# Altium schematic sheet Puissance.SchDoc
size A3; SheetNumber: 1; SheetTotal: 2
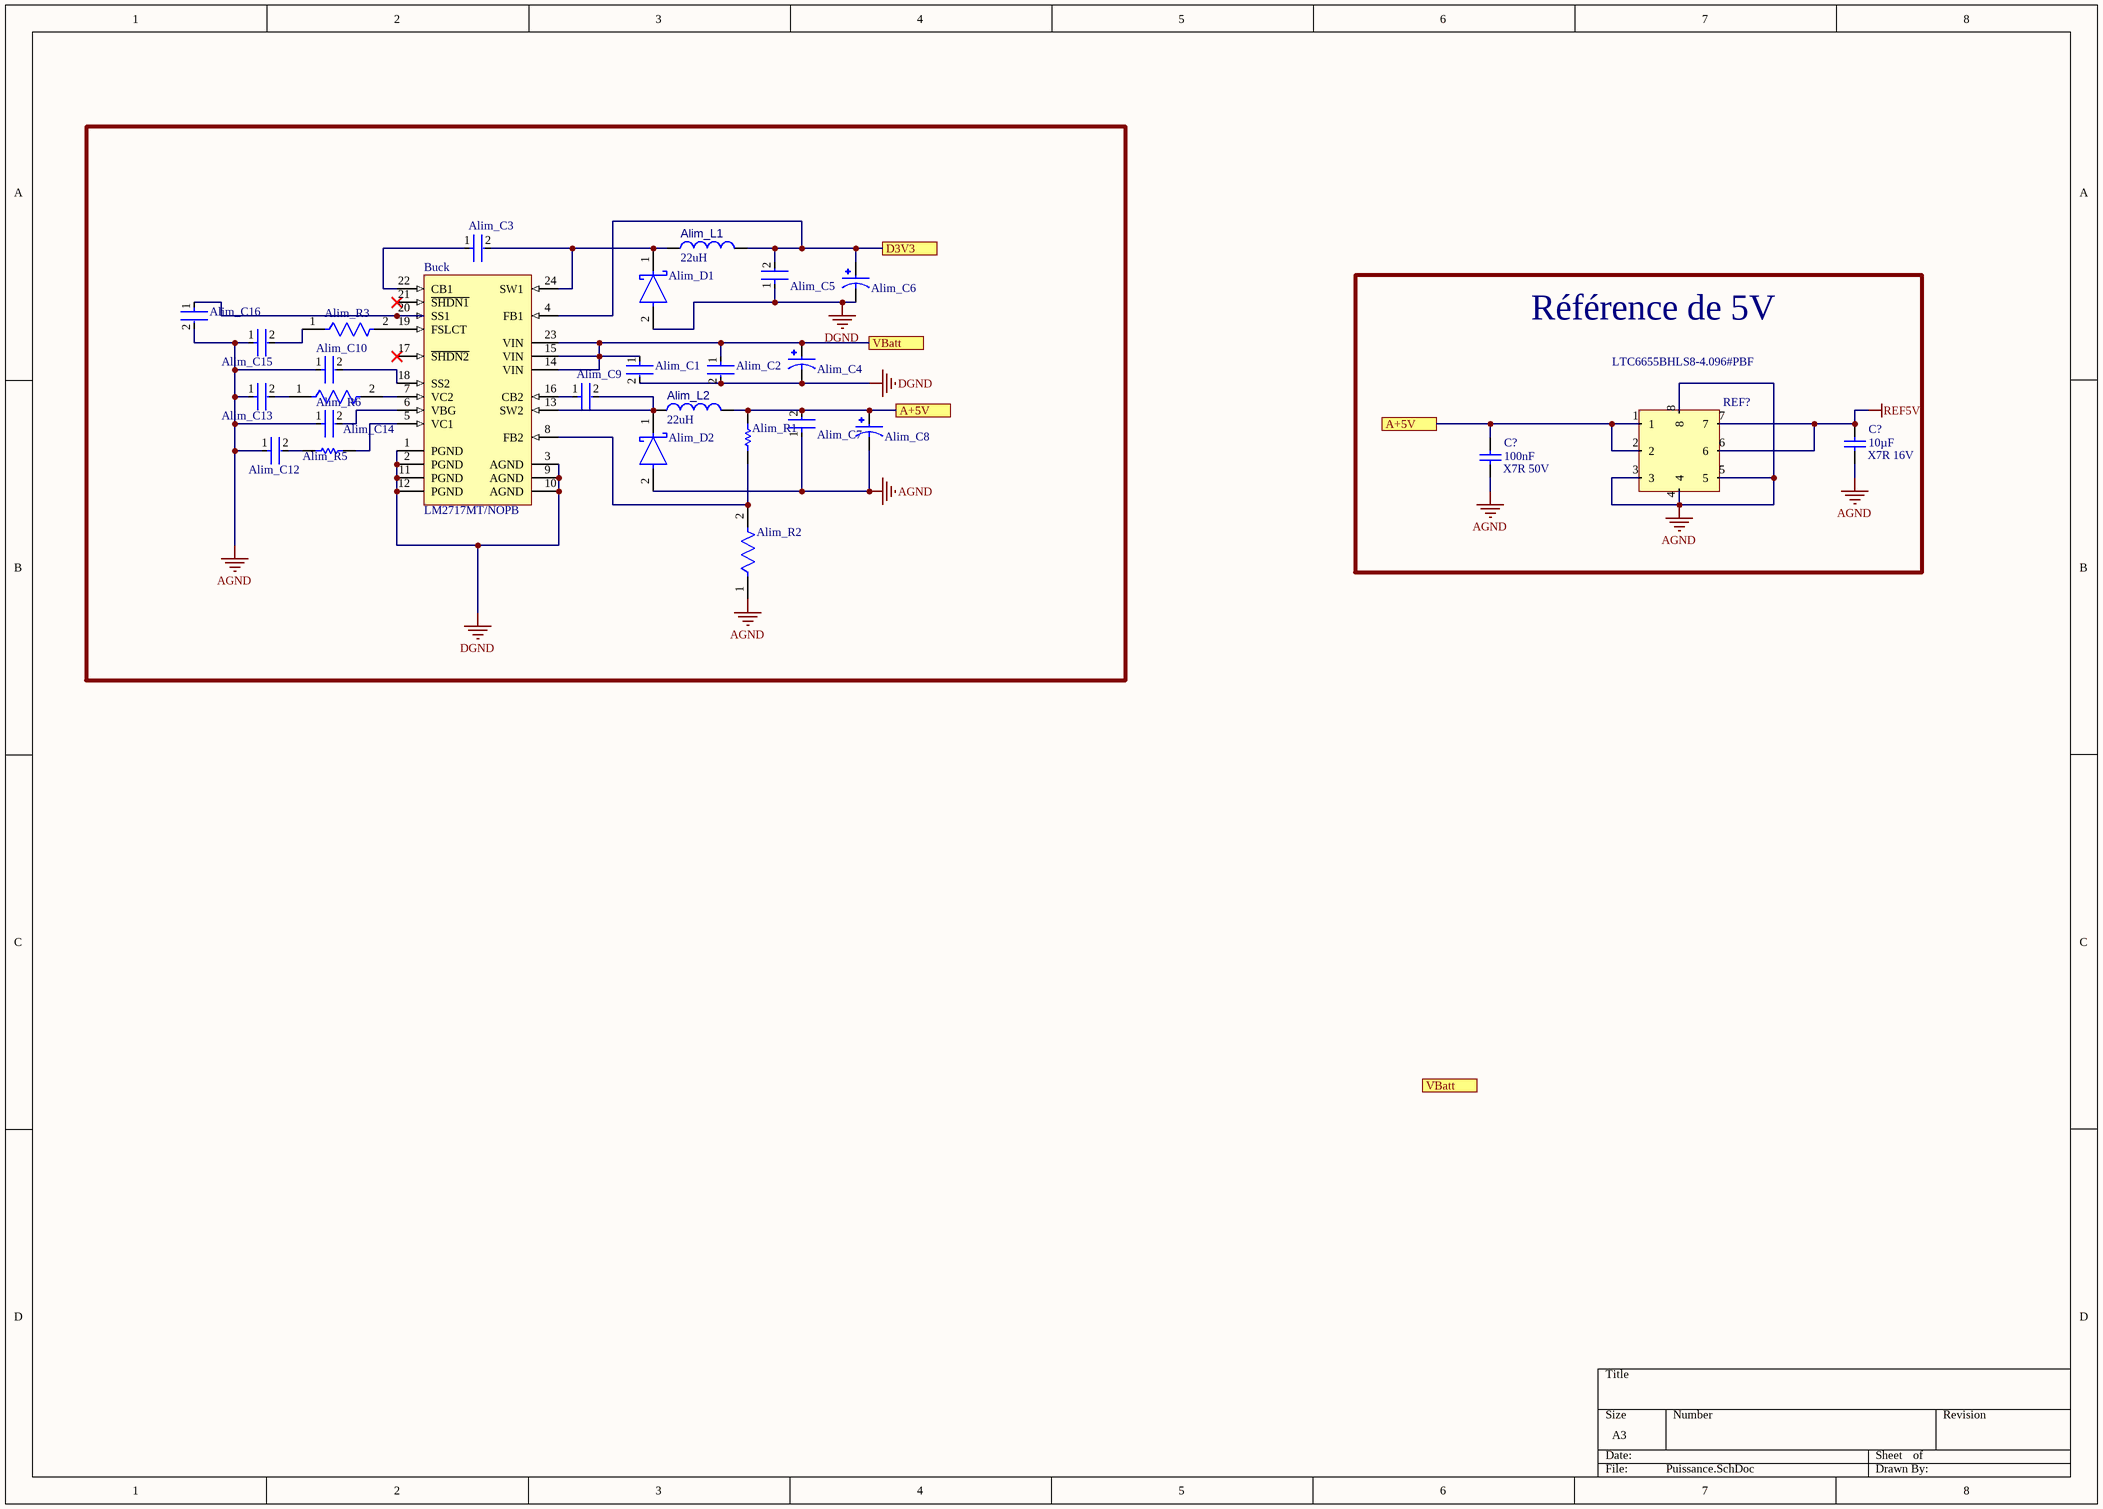
[diagram p0: Puissance.SchDoc]

## Parts
(Parts that share a designator on the sheet are numbered #1, #2 ... from top to bottom, then left to right.)
Alim_C1  C2012X5R1H475K125AB  [FP-C2012-125-0_2-IPC_B]  (value not drawn)
Alim_C2  C2012X5R1H475K125AB  [FP-C2012-125-0_2-IPC_B]  (value not drawn)
Alim_C3  CGA8P3X7T2E105K250KA  [FP-CGA8R-IPC_B]  (value not drawn)
Alim_C4  EEU-EE2G680  [EEU-EE2G680-Footprint-1]  (value not drawn)
Alim_C5  CGA8P3X7T2E105K250KA  [FP-CGA8R-IPC_B]  (value not drawn)
Alim_C6  EEU-EE2G680  [EEU-EE2G680-Footprint-1]  (value not drawn)
Alim_C7  CGA8P3X7T2E105K250KA  [FP-CGA8R-IPC_B]  (value not drawn)
Alim_C8  EEU-EE2G680  [EEU-EE2G680-Footprint-1]  (value not drawn)
Alim_C9  CGA8P3X7T2E105K250KA  [FP-CGA8R-IPC_B]  (value not drawn)
Alim_C10  06035C473K4T2A  [FP-0603-L_1_6_0_15-W_0_81-MFG]  (value not drawn)
Alim_C12  C0603C472K5RACTU  [FP-C0603C-CF-MFG]  (value not drawn)
Alim_C13  C0603C472K5RACTU  [FP-C0603C-CF-MFG]  (value not drawn)
Alim_C14  08051C102KAT2A  [FP-0805-L_2_01_0_2-W_1_25-IPC_C]  (value not drawn)
Alim_C15  C0603C472K5RACTU  [FP-C0603C-CF-MFG]  (value not drawn)
Alim_C16  06035C473K4T2A  [FP-0603-L_1_6_0_15-W_0_81-MFG]  (value not drawn)
Alim_D1  VS-30BQ100-M3/9AT  [FP-95402-MFG]  (value not drawn)
Alim_D2  VS-30BQ100-M3/9AT  [FP-95402-MFG]  (value not drawn)
Alim_L1  value 22uH  [XAL5050-223MEC-Footprint-1]  (hidden comment: XAL5050-223MEC)
Alim_L2  value 22uH  [XAL5050-223MEC-Footprint-1]  (hidden comment: XAL5050-223MEC)
Alim_R1  CRCW120659K0FKEA  [RESC3216X60X45ML10T20]  (value not drawn)
Alim_R2  MCT0603PD2002DP500  [FP-MCT0603-IPC_A]  (value not drawn)
Alim_R3  CRCW080520K5FKEA  [FP-CRCW0805-e3-MFG]  (value not drawn)
Alim_R5  RC0402FR-0710KL  [RESC1005X40X25LL05T10]  (value not drawn)
Alim_R6  MCT0603PD2002DP500  [FP-MCT0603-IPC_A]  (value not drawn)
Buck  LM2717MT/NOPB  [PW0024A_L]
C?#1  X7R 16V  value 10µF  [1206]
C?#2  X7R 50V  value 100nF  [0603]
REF?  LTC6655BHLS8-4.096#PBF  [LTC6655BHLS8-4.096#PBF-Footprint-1]

## Blocks framed on the sheet
Référence de 5V: C?#1 C?#2 REF?

## Ports
A+5V, D3V3, VBatt

## Nets
AGND: Alim_C7.1 Alim_C8.N Alim_C10.1 Alim_C12.1 Alim_C13.1 Alim_C14.1 Alim_C15.1 Alim_C16.2 Alim_D2.2(A) Alim_R2.1 C?#1.1 C?#2.1 REF?.3 REF?.4 REF?.5 REF?.8
DGND: Alim_C1.2 Alim_C2.2 Alim_C4.N Alim_C5.1 Alim_C6.N Alim_D1.2(A) Buck.1(PGND) Buck.2(PGND) Buck.3(AGND) Buck.9(AGND) Buck.10(AGND) Buck.11(PGND) Buck.12(PGND)
REF5V: C?#1.2 REF?.6 REF?.7
A+5V: Alim_C7.2 Alim_C8.P Alim_L2.2 Alim_R1.2 C?#2.2 REF?.1 REF?.2 ; port A+5V
D3V3: Alim_C5.2 Alim_C6.P Alim_L1.2 Buck.4(FB1) ; port D3V3
VBatt: Alim_C1.1 Alim_C2.1 Alim_C4.P Buck.14(VIN) Buck.15(VIN) Buck.23(VIN) ; port VBatt
NetAlim_C3_1: Alim_C3.1 Buck.22(CB1)
NetAlim_C3_2: Alim_C3.2 Alim_D1.1(C) Alim_L1.1 Buck.24(SW1)
NetAlim_C9_1: Alim_C9.1 Buck.16(CB2)
NetAlim_C9_2: Alim_C9.2 Alim_D2.1(C) Alim_L2.1 Buck.13(SW2)
NetAlim_C10_2: Alim_C10.2 Buck.18(SS2)
NetAlim_C12_2: Alim_C12.2 Alim_R5.1
NetAlim_C13_2: Alim_C13.2 Alim_R6.1
NetAlim_C14_2: Alim_C14.2 Buck.6(VBG)
NetAlim_C15_2: Alim_C15.2 Alim_R3.1
NetAlim_C16_1: Alim_C16.1 Buck.20(SS1)
NetAlim_R1_1: Alim_R1.1 Alim_R2.2 Buck.8(FB2)
NetAlim_R3_2: Alim_R3.2 Buck.19(FSLCT)
NetAlim_R5_2: Alim_R5.2 Buck.5(VC1)
NetAlim_R6_2: Alim_R6.2 Buck.7(VC2)

Not connected (* = marked no-connect by the designer): Buck 17(~{SHDN2})* 21(~{SHDN1})*

## Library data of the parts
Alim_C1 Alim_C2 = CMP-08246-000007-2: Multilayer Ceramic Capacitors 4.7μF ±10% 50V X5R SMD 0805; Capacitance: 4.7uF; Case Code (Metric): 2012; Weight: 0.000194oz; Voltage Rating: 50V; Voltage: 50V; Construction: Flat; Series: C; Packaging: Tape and Reel; Height: 1.25mm; Depth: 1.25mm; Resistor Type: Ceramic; Width: 0.049inch; Length: 2mm; Thickness: 0.057inch; REACH SVHC: No SVHC; Max Operating Temperature: 85°C; Case/Package: 0805; Dielectric: X5R; Tolerance: 10%; Dielectric Material: Ceramic; Package Quantity: 1; Mount: Surface Mount; Radiation Hardening: No; Voltage Rating (DC): 50V; Case Code (Imperial): 0805; Termination: SMD/SMT; Min Operating Temperature: -55°C; Lead Free: Lead Free
Alim_C3 Alim_C5 Alim_C7 Alim_C9 = CMP-08246-002426-1: Cap Ceramic 1uF 250V X7T 10% Pad SMD 1812 +125°C Automotive T/R; Width: 0.126inch; Length: 4.5mm; Thickness: 0.098inch; Depth: 3.2mm; Tolerance: 10%; Max Operating Temperature: 125°C; Dielectric: X7T; Case/Package: 1812; Packaging: Tape and Reel; Mount: Surface Mount; Termination: SMD/SMT; Case Code (Metric): 4532; Package Quantity: 1; Voltage Rating: 250V; Case Code (Imperial): 1812; Min Operating Temperature: -55°C; Ratings: AEC-Q200; Composition: Ceramic; REACH SVHC: No SVHC; Height: 2.5mm; Voltage Rating (DC): 250V; Capacitance: 1uF; Weight: 0.000952oz
Alim_C4 Alim_C6 Alim_C8 = CMP-001-00134-1: Capacitor; Aluminum Electrolytic; Capacitor Radial EE 68uF 400V Hi-Ripple
Alim_C10 Alim_C16 = CMP-2006-04442-2: Automotive Ceramic Capacitor, 0603, 47nF, 10%, X7R, 15%, 50V; Package Quantity: 4000; Voltage Rating: 50V; Max Operating Temperature: 125°C; RoHS Compliant: Yes; Case/Package: 0603; Voltage Rating (DC): 50V; Depth: 0.81mm; Thickness: 0.035inch; Mount: Surface Mount; Height: 0.9mm; Series: -; Tolerance: 10%; Termination: SMD/SMT; Capacitance: 47nF; Dielectric: X7R; Case Code (Metric): 1608; Lead Free: Lead Free; REACH SVHC: No SVHC; Min Operating Temperature: -55°C; Length: 1.6mm; Radiation Hardening: No; Packaging: Tape and Reel; Ratings: AEC-Q200; Width: 0.81mm; Case Code (Imperial): 0603
Alim_C12 Alim_C13 Alim_C15 = CMP-1035-02203-3: CAP CER 4700PF 50V X7R 0603; Manufacturer: KEMET; Tolerance: 0.1; Capacitance: 4,700 pF; Description: C0603 4,700 pF X7R 30ppm/°C 10.00% 50 V; Value: 4,700 pF; Automotive Grade: Grade 1; Temperature Coefficient: 30ppm/°C; Device Class L1: Passive Components; Automotive: Yes; Temperature Characteristic: X7R; Manufacturer Part Number: C0603C472K5RACTU; Package: C0603C-CF; ComponentLink2Description: Datasheet; Temperature Range Low: -55°C; Material: Ceramic; RoHS: TRUE; Device Class L3: Ceramic Capacitors; ComponentLink2URL: https://api.kemet.com/component-edge/download/datasheet/C0603C100J5GACAUTO.pdf; Device Class L2: Capacitors; Category: Cap; Mouser Description: Capacitor: ceramic; MLCC; 4.7nF; 50VDC; X7R; ±10%; SMD; 0603; Temperature Range High: +125°C; Temperature: -55°C to +125°C; Octopart: https://octopart.com/c0603c472k5ractu-kemet-126175; Digikey Description: CAP CER 4700PF 50V X7R 0603; Voltage Rating: 50 V; Lead Free: Yes; Height: 0.87mm
Alim_C14 = CMP-2007-04159-2: General Purpose Ceramic Capacitor, 0805, 1nF, 10%, X7R, 0.15, 100V; Dissipation Factor: 2.5%; Tolerance: 10%; Depth: 1.25mm; Max Operating Temperature: 125°C; Case Code (Metric): 2012; Series: -; Contact Plating: Tin; RoHS Compliant: Yes; Dielectric: X7R; Number of Pins: 2; Thickness: 0.037inch; Lead Free: Lead Free; Width: 0.049inch; Radiation Hardening: No; Case/Package: 0805; Min Operating Temperature: -55°C; Voltage Rating (DC): 100V; Case Code (Imperial): 0805; Capacitance: 1nF; Voltage: 100V; Construction: Flat; Length: 2.01mm; Package Quantity: 1; Height: 0.94mm; Packaging: Tape and Reel; REACH SVHC: No SVHC; Voltage Rating: 100V; Mount: Surface Mount; Termination: SMD/SMT
Alim_D1 Alim_D2 = CMP-02539-000018-1: DIODE SCHOTTKY 3.0A SMC; Manufacturer: Vishay; Description: Diode Schottky 100V 3A Surface Mount SMC; Max Repetitive Reverse Voltage: 100V; Max Junction Temp: +175°C; Capacitance: 115pF; Forward Current: 3A; Peak Reverse Current: 0.5mA; Value: 115pF; Standoff Height: 0mm; Max Surge Forward Current: 800A; Lead Free: Yes; RoHS: TRUE; ComponentLink2Description: Datasheet; Temperature Range Low: -55°C; Device Class L2: Diodes; Mouser Description: Schottky Diodes & Rectifiers 3A 100V Single Die Schottky Rectifier; ComponentLink2URL: http://www.vishay.com/docs/93360/vs-30bq100m.pdf; Digikey Description: DIODE SCHOTTKY 3.0A SMC; Category: Diode; Package: 95402; Octopart: https://octopart.com/vs-30bq100-m3%2F9at-vishay-39003641; Automotive: No; Temperature: -55°C to +175°C; Reverse Voltage: 100V; Device Class L3: Schottky Diodes; Temperature Range High: +175°C; Footprint Url: https://www.vishay.com/docs/95402/smc.pdf; Device Class L1: Discrete Semiconductors; Manufacturer Part Number: VS-30BQ100-M3/9AT; Height: 2.62mm
Alim_L1 Alim_L2 = CMP-006-00021-3: INDUCTOR, 22UH, 3.4A, 20%,11MHZ, REEL
Alim_R1 = CMP-2003-02293-1: Manufacturer: Vishay Dale; Part Number: CRCW120659K0FKEA
Alim_R2 Alim_R6 = CMP-02407-001404-1: RES SMD 100 OHM 1% 1/8W 0603; Temperature Coefficient: 25ppm/°C; Resistance: 20kR; Max Power Dissipation: 250mW; Tolerance: 0.5%; Number of Terminations: 2; Min Operating Temperature: -55°C; Packaging: Cut Tape; Composition: Thin Film; Case/Package: 0603; Max Operating Temperature: 175°C; Case Code (Imperial): 0603; Case Code (Metric): 1608; Features: Automotive AEC-Q200
Alim_R3 = CMP-02407-005551-1: RES Thick Film, 20.5kΩ, 1%, 0.125W, 100ppm/°C, 0805; Power Rating: 125mW; Resistance: 20.5kR; Voltage Rating (DC): 150V; Min Operating Temperature: -55°C; Tolerance: 1%; Composition: Thick Film; Case/Package: 0805; Termination: SMD/SMT; Radiation Hardening: No; Case Code (Metric): 2012; Case Code (Imperial): 0805; Width: 0.049inch; Depth: 1.25mm; Max Power Dissipation: 125mW; Lead Free: Lead Free; Contact Plating: Tin; Temperature Coefficient: 100ppm/°C; Military Standard: Not; Packaging: Tape and Reel; Number of Terminations: 2; Package Quantity: 10; Features: Automotive AEC-Q200; Weight: 0.000194oz; Max Operating Temperature: 155°C; Voltage Rating: 150V; Height: 0.45mm; Length: 2mm
Alim_R5 = CMP-2002-07353-1: Manufacturer: Yageo / Phycomp; Part Number: RC0402FR-0710KL
Buck = CMP-0069-01764-3: Dual Step-Down DC/DC Converter, 24-pin TSSOP, Pb-Free; Manufacturer: Texas Instruments; CompType: Switcher; PowerWise: N; PackageTopMarking: NSUZXYTTE#*LM2717MT; ComponentLink1URL: http://www.ti.com/general/docs/lit/getliterature.tsp?genericPartNumber=LM2717&fileType=pdf; RoHS: Y; ComponentLink1Description: Datasheet URL; PackageDescription: Molded TSSOP, Jedec, 7.8 x 4.4 x 0.9mm Body, 24 Lead, 0.65mm Pitch; Code_JEDEC: MO-153-AD; PackageReference: PW0024A; PinCount: 24
C?#1 C?#2 = Cap CMS: Capacitor (Semiconductor SIM Model); Published: 8-Jun-2000; LatestRevisionDate: 29-May-2009; LatestRevisionNote: IPC-7351 Footprint Added.; PackageReference: C1206; Publisher: Altium Limited; PackageDescription: Chip Capacitor
REF? = CMP-019-00060-3: V-Ref Precision 4.096V 5mA Automotive 8-Pin CLLCC Tray